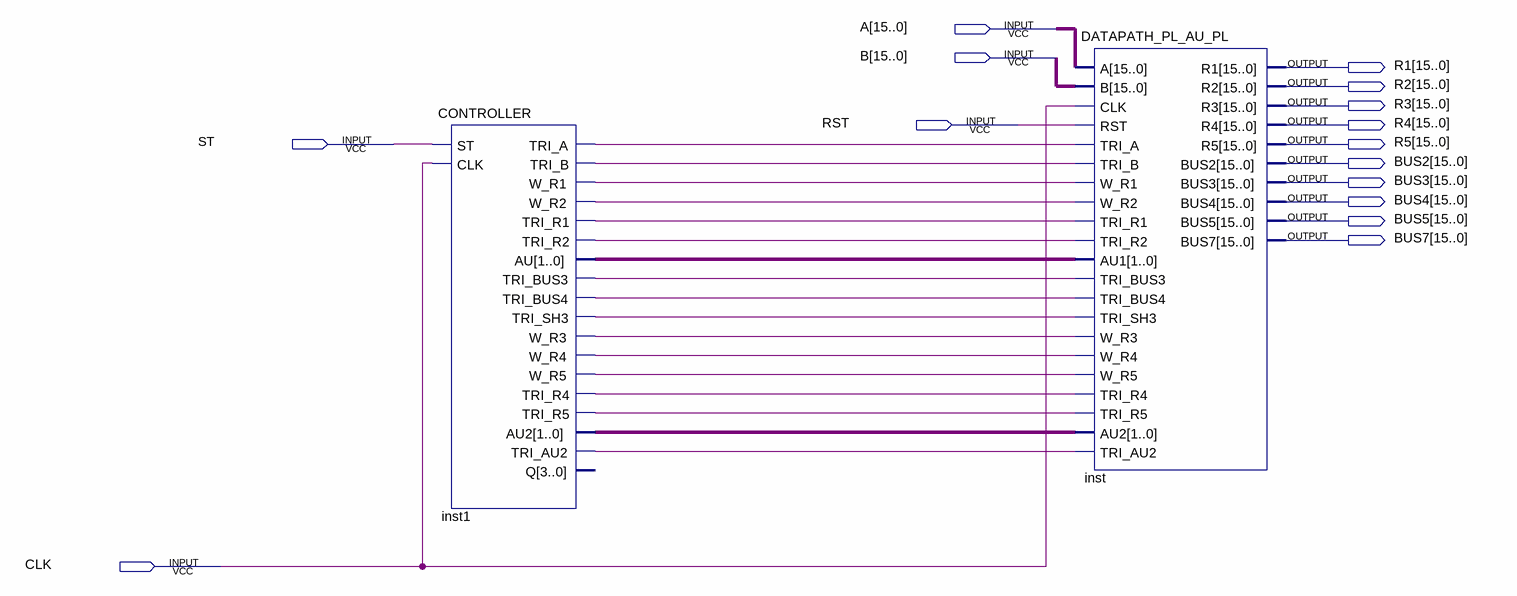
[diagram p0: schematic sheet]
// Quartus schematic PIPELINE_DP_AU.bdf as structural Verilog: 2 symbols, 15 pins
module PIPELINE_DP_AU (
  input  [15:0] A,
  input  [15:0] B,
  input  RST,
  input  ST,
  input  CLK,
  output [15:0] R1,
  output [15:0] R2,
  output [15:0] R3,
  output [15:0] R4,
  output [15:0] R5,
  output [15:0] BUS2,
  output [15:0] BUS3,
  output [15:0] BUS4,
  output [15:0] BUS5,
  output [15:0] BUS7
);

  wire inst1_tri_a, inst1_tri_au2, inst1_tri_b, inst1_tri_bus3, inst1_tri_bus4, inst1_tri_r1, inst1_tri_r2,
       inst1_tri_r4, inst1_tri_r5, inst1_tri_sh3, inst1_w_r1, inst1_w_r2, inst1_w_r3, inst1_w_r4, inst1_w_r5;
  wire [1:0] inst1_au, inst1_au2;

  CONTROLLER inst1 (
    .ST(ST), .CLK(CLK), .TRI_A(inst1_tri_a), .TRI_B(inst1_tri_b), .W_R1(inst1_w_r1), .W_R2(inst1_w_r2),
    .TRI_R1(inst1_tri_r1), .TRI_R2(inst1_tri_r2), .AU(inst1_au), .TRI_BUS3(inst1_tri_bus3),
    .TRI_BUS4(inst1_tri_bus4), .TRI_SH3(inst1_tri_sh3), .W_R3(inst1_w_r3), .W_R4(inst1_w_r4),
    .W_R5(inst1_w_r5), .TRI_R4(inst1_tri_r4), .TRI_R5(inst1_tri_r5), .AU2(inst1_au2), .TRI_AU2(inst1_tri_au2));  // open: Q
  DATAPATH_PL_AU_PL inst (
    .A(A), .B(B), .CLK(CLK), .RST(RST), .TRI_A(inst1_tri_a), .TRI_B(inst1_tri_b), .W_R1(inst1_w_r1),
    .W_R2(inst1_w_r2), .TRI_R1(inst1_tri_r1), .TRI_R2(inst1_tri_r2), .AU1(inst1_au),
    .TRI_BUS3(inst1_tri_bus3), .TRI_BUS4(inst1_tri_bus4), .TRI_SH3(inst1_tri_sh3), .W_R3(inst1_w_r3),
    .W_R4(inst1_w_r4), .W_R5(inst1_w_r5), .TRI_R4(inst1_tri_r4), .TRI_R5(inst1_tri_r5), .AU2(inst1_au2),
    .TRI_AU2(inst1_tri_au2), .R1(R1), .R2(R2), .R3(R3), .R4(R4), .R5(R5), .BUS2(BUS2), .BUS3(BUS3),
    .BUS4(BUS4), .BUS5(BUS5), .BUS7(BUS7));
endmodule
